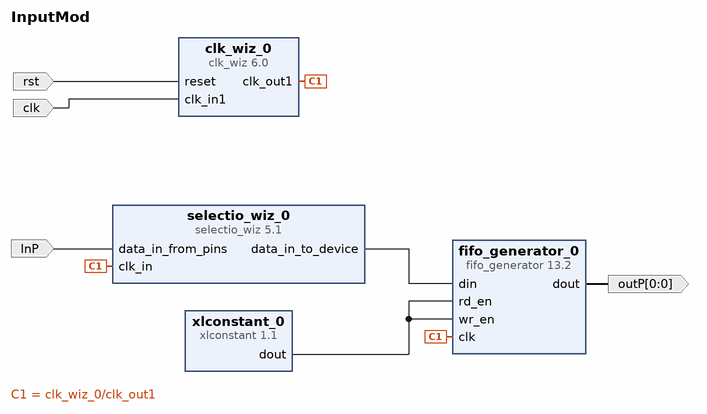
[diagram p0: block diagram of the top level]
# Vivado block design InputMod, xc7s50csga324-1, Vivado 2018.2
create_bd_design InputMod

create_bd_port -dir I -type clk clk
create_bd_port -dir I -type rst rst
set_property -dict {CONFIG.POLARITY ACTIVE_HIGH} [get_bd_ports rst]
create_bd_port -dir I InP
create_bd_port -dir O -from 0 -to 0 outP

create_bd_cell -type ip -vlnv xilinx.com:ip:selectio_wiz:5.1 selectio_wiz_0
set_property -dict [list \
  CONFIG.BUS_IO_STD LVCMOS33 \
  CONFIG.SERIALIZATION_FACTOR 4 \
  CONFIG.SELIO_CLK_IO_STD LVCMOS33 \
  CONFIG.SELIO_CLK_BUF MMCM \
  CONFIG.CLK_FWD_IO_STD LVCMOS33 \
] [get_bd_cells selectio_wiz_0]
create_bd_cell -type ip -vlnv xilinx.com:ip:xlconstant:1.1 xlconstant_0
create_bd_cell -type ip -vlnv xilinx.com:ip:fifo_generator:13.2 fifo_generator_0
set_property -dict [list \
  CONFIG.Fifo_Implementation Common_Clock_Builtin_FIFO \
  CONFIG.Performance_Options Standard_FIFO \
  CONFIG.Input_Data_Width 1 \
  CONFIG.Enable_ECC false \
  CONFIG.Use_Embedded_Registers false \
] [get_bd_cells fifo_generator_0]
create_bd_cell -type ip -vlnv xilinx.com:ip:clk_wiz:6.0 clk_wiz_0
set_property -dict [list \
  CONFIG.CLKOUT1_REQUESTED_OUT_FREQ 10 \
  CONFIG.MMCM_DIVCLK_DIVIDE 2 \
  CONFIG.MMCM_CLKFBOUT_MULT_F 15.625 \
  CONFIG.MMCM_CLKOUT0_DIVIDE_F 78.125 \
  CONFIG.CLKOUT1_JITTER 290.478 \
  CONFIG.CLKOUT1_PHASE_ERROR 133.882 \
] [get_bd_cells clk_wiz_0]

# ---- connections ----

connect_bd_net [get_bd_pins selectio_wiz_0/data_in_to_device] [get_bd_pins fifo_generator_0/din]
connect_bd_net [get_bd_pins xlconstant_0/dout] [get_bd_pins fifo_generator_0/wr_en] [get_bd_pins fifo_generator_0/rd_en]
connect_bd_net [get_bd_ports rst] [get_bd_pins clk_wiz_0/reset]
connect_bd_net [get_bd_ports clk] [get_bd_pins clk_wiz_0/clk_in1]
connect_bd_net [get_bd_pins clk_wiz_0/clk_out1] [get_bd_pins fifo_generator_0/clk] [get_bd_pins selectio_wiz_0/clk_in]
connect_bd_net [get_bd_ports InP] [get_bd_pins selectio_wiz_0/data_in_from_pins]
connect_bd_net [get_bd_pins fifo_generator_0/dout] [get_bd_ports outP]

validate_bd_design
save_bd_design
